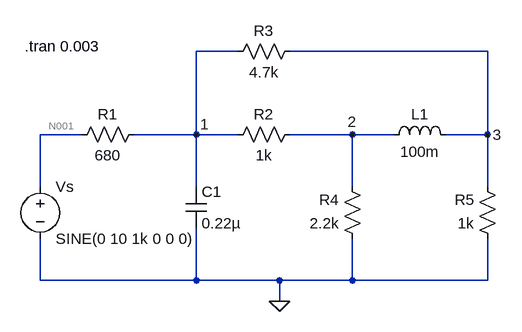
[diagram p0: schematic lab3_00.asc]
lab3_00.asc, the LTspice schematic file:
Version 4
SHEET 1 880 680
WIRE 368 -64 304 -64
WIRE 752 -64 448 -64
WIRE 128 64 64 64
WIRE 304 64 304 -64
WIRE 304 64 208 64
WIRE 368 64 304 64
WIRE 544 64 448 64
WIRE 608 64 544 64
WIRE 752 64 752 -64
WIRE 752 64 688 64
WIRE 64 144 64 64
WIRE 304 144 304 64
WIRE 544 144 544 64
WIRE 752 144 752 64
WIRE 64 288 64 224
WIRE 304 288 304 208
WIRE 304 288 64 288
WIRE 432 288 304 288
WIRE 544 288 544 224
WIRE 544 288 432 288
WIRE 752 288 752 224
WIRE 752 288 544 288
WIRE 432 320 432 288
FLAG 432 320 0
FLAG 304 64 1
FLAG 544 64 2
FLAG 752 64 3
SYMBOL voltage 64 128 R0
WINDOW 123 0 0 Left 0
WINDOW 39 0 0 Left 0
SYMATTR InstName Vs
SYMATTR Value SINE(0 10 1k 0 0 0)
SYMBOL res 224 48 R90
WINDOW 0 0 56 VBottom 2
WINDOW 3 32 56 VTop 2
SYMATTR InstName R1
SYMATTR Value 680
SYMBOL res 464 48 R90
WINDOW 0 0 56 VBottom 2
WINDOW 3 32 56 VTop 2
SYMATTR InstName R2
SYMATTR Value 1k
SYMBOL res 464 -80 R90
WINDOW 0 0 56 VBottom 2
WINDOW 3 32 56 VTop 2
SYMATTR InstName R3
SYMATTR Value 4.7k
SYMBOL res 560 240 R180
WINDOW 0 36 76 Left 2
WINDOW 3 36 40 Left 2
SYMATTR InstName R4
SYMATTR Value 2.2k
SYMBOL res 768 240 R180
WINDOW 0 36 76 Left 2
WINDOW 3 36 40 Left 2
SYMATTR InstName R5
SYMATTR Value 1k
SYMBOL ind 592 80 R270
WINDOW 0 32 56 VTop 2
WINDOW 3 5 56 VBottom 2
SYMATTR InstName L1
SYMATTR Value 100m
SYMBOL cap 288 144 R0
SYMATTR InstName C1
SYMATTR Value 0.22µ
TEXT 40 -72 Left 2 !.tran 0.003

The netlist it stands for:
* lab3_00.asc
Vs N001 0 SINE(0 10 1k 0 0 0)
R1 1 N001 680
R2 2 1 1k
R3 3 1 4.7k
R4 0 2 2.2k
R5 0 3 1k
L1 2 3 100m
C1 1 0 0.22µ
.tran 0.003
.backanno
.end

* Results of the author's LTspice run, read from the files saved beside the schematic
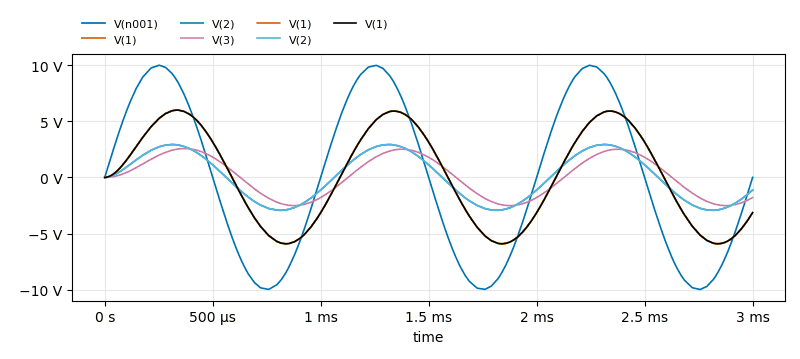
[diagram p1: Transient Analysis of lab3_00.asc, plotted from the saved traces]
* Transient Analysis, 1 run:
*   V(n001): min -9.989 V, max 9.999 V, average -291.8 µV, rms 7.062 V, last 0 V
*   V(1): min -5.914 V, max 5.997 V, average 100.3 mV, rms 4.195 V, last -3.142 V
*   V(2): min -2.932 V, max 2.933 V, average 22.68 mV, rms 2.073 V, last -1.123 V
*   V(3): min -2.515 V, max 2.574 V, average 73.09 mV, rms 1.783 V, last -1.795 V
*   V(1): min -5.914 V, max 5.997 V, average 100.3 mV, rms 4.195 V, last -3.142 V
*   V(2): min -2.932 V, max 2.933 V, average 22.68 mV, rms 2.073 V, last -1.123 V
*   V(1): min -5.914 V, max 5.997 V, average 100.3 mV, rms 4.195 V, last -3.142 V